# EAGLE schematic tda1543-iv-test (EAGLE 7.4.0)
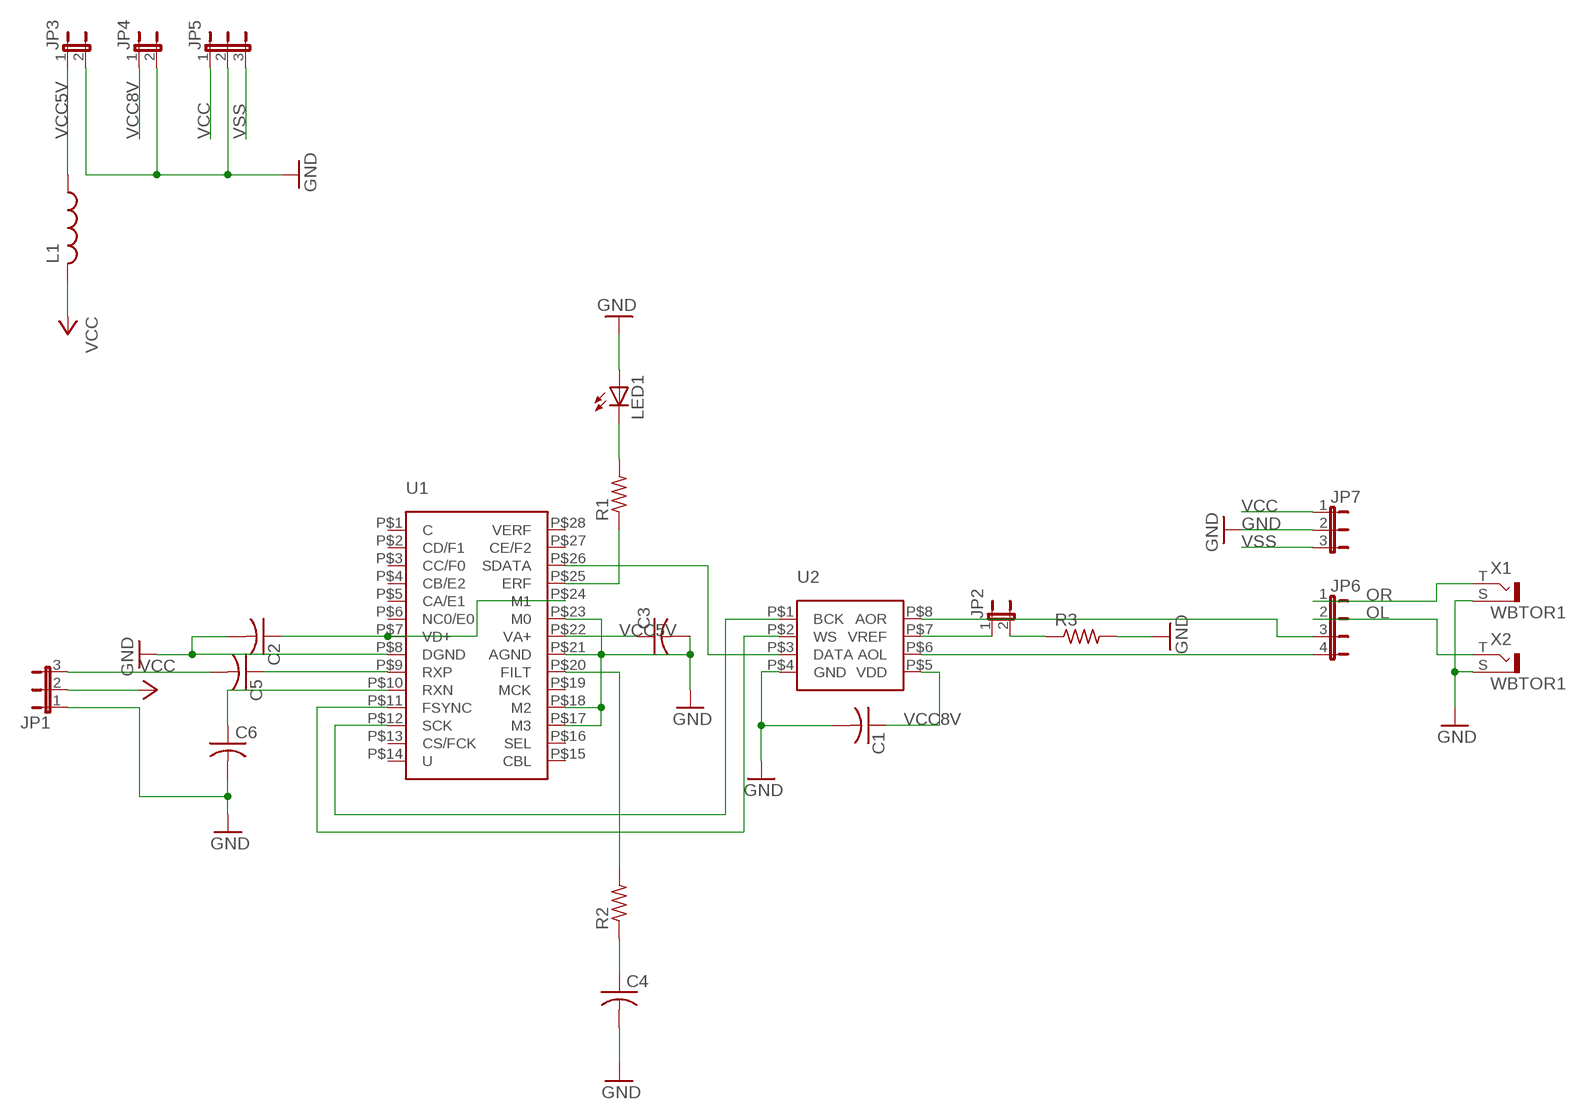
[diagram p0: schematic, sheet 1]

## Parts
C1  C-USC0805  [C0805]
C2  C-USC0805  [C0805]
C3  C-USC0805  [C0805]
C4  C-USC0805  [C0805]
C5  C-USC0805  [C0805]
C6  C-USC0805  [C0805]
JP1  JP2E  [JP2]
JP2  JP1E  [JP1]
JP3  JP1E  [JP1]
JP4  JP1E  [JP1]
JP5  JP2E  [JP2]
JP6  JP4E  [JP4]
JP7  JP2E  [JP2]
L1  L-USL2012C  [L2012C]
LED1  LED3MM  [LED3MM]
R1  R-US_R0805  [R0805]
R2  R-US_R0805  [R0805]
R3  R-US_R0805  [R0805]
U1  CS8412  [DIP14]
U2  TDA1543  [DIP8]
X1  WBTOR1  [WBTOR1]
X2  WBTOR1  [WBTOR1]

## Nets
GND: C1.2 C2.2 C3.2 C4.2 C6.2 JP1.1 JP3.2 JP4.2 JP5.2 JP7.2 LED1.A R3.2 U1.P$8(DGND) U1.P$17(M3) U1.P$18(M2) U1.P$21(AGND) U1.P$23(M0) U2.P$4(GND) X1.S X2.S
N$1: U1.P$12(SCK) U2.P$1(BCK)
N$2: U1.P$11(FSYNC) U2.P$2(WS)
N$4: U1.P$26(SDATA) U2.P$3(DATA)
N$5: C5.2 JP1.3
N$7: C2.1 U1.P$7(VD+) U1.P$24(M1)
N$9: JP2.1 U2.P$7(VREF)
N$10: JP2.2 R3.1
N$11: R1.1 U1.P$25(ERF)
N$12: LED1.K(C) R1.2
N$13: R2.2 U1.P$20(FILT)
N$14: C4.1 R2.1
N$15: C6.1 U1.P$10(RXN)
N$16: C5.1 U1.P$9(RXP)
N$18: JP6.3 U2.P$8(AOR)
N$19: JP6.4 U2.P$6(AOL)
OL: JP6.2 X2.T
OR: JP6.1 X1.T
VCC: JP1.2 JP5.1 JP7.1 L1.2
VCC5V: C3.1 JP3.1 L1.1 U1.P$22(VA+)
VCC8V: C1.1 JP4.1 U2.P$5(VDD)
VSS: JP5.3 JP7.3
Unconnected: U1.P$1(C) U1.P$2(CD/F1) U1.P$3(CC/F0) U1.P$4(CB/E2) U1.P$5(CA/E1) U1.P$6(NC0/E0) U1.P$13(CS/FCK) U1.P$14(U) U1.P$15(CBL) U1.P$16(SEL) U1.P$19(MCK) U1.P$27(CE/F2) U1.P$28(VERF)

## Library data of the parts
C1-C6 = rcl:C-US: CAPACITOR, American symbol
JP1 JP5 JP7 = jumper:JP2E: JUMPER
JP2-JP4 = jumper:JP1E: JUMPER
JP6 = jumper:JP4E: JUMPER
L1 = rcl:L-US: INDUCTOR, American symbol
LED1 = led:LED: LED OSRAM: - CHIPLED LG R971, LG N971, LY N971, LG Q971, LY Q971, LO R971, LY R971 LH N974, LH R974 LS Q976, LO Q976, LY Q976 LO Q996 - Hyper CHIPLED LW Q18S LB Q993, LB Q99A, LB R99A - SideLED LS A670, LO A670, LY A670, LG A670, LP A670 LB A673, LV A673, LT A673, LW A673 LH A674 LY A675 LS A676, LA A676, LO A676, LY A676, LW A676 LS A679, LY A679, LG A679 - Hyper Micro SIDELED® LS Y876, LA Y876, LO Y876, LY Y876 LT Y87S - SmartLED LW L88C, LW L88S LB L89C, LB L89S, LG L890 LS L89K, LO L89K, LY L89K LS L896, LA L896, LO L896, LY L896 - TOPLED LS T670, LO T670, LY T670, LG T670, LP T670 LSG T670, LSP T670, LSY T670, LOP T670, LYG T670 LG T671, LOG T671, LSG T671 LB T673, LV T673, LT T673, LW T673 LH T674 LS T676, LA T676, LO T676, LY T676, LB T676, LH T676, LSB T676, LW T676 LB T67C, LV T67C, LT T67C, LS T67K, LO T67K, LY T67K, LW E67C LS E67B, LA E67B, LO E67B, LY E67B, LB E67C, LV E67C, LT E67C LW T67C LS T679, LY T679, LG T679 LS T770, LO T770, LY T770, LG T770, LP T770 LB T773, LV T773, LT T773, LW T773 LH T774 LS E675, LA E675, LY E675, LS T675 LS T776, LA T776, LO T776, LY T776, LB T776 LHGB T686 LT T68C, LB T68C - Hyper Mini TOPLED® LB M676 - Mini TOPLED Santana® LG M470 LS M47K, LO M47K, LY M47K Source: http://www.osram.convergy.de LUXEON: - LUMILED® LXK2-PW12-R00, LXK2-PW12-S00, LXK2-PW14-U00, LXK2-PW14-V00 LXK2-PM12-R00, LXK2-PM12-S00, LXK2-PM14-U00 LXK2-PE12-Q00, LXK2-PE12-R00, LXK2-PE12-S00, LXK2-PE14-T00, LXK2-PE14-U00 LXK2-PB12-K00, LXK2-PB12-L00, LXK2-PB12-M00, LXK2-PB14-N00, LXK2-PB14-P00, LXK2-PB14-Q00 LXK2-PR12-L00, LXK2-PR12-M00, LXK2-PR14-Q00, LXK2-PR14-R00 LXK2-PD12-Q00, LXK2-PD12-R00, LXK2-PD12-S00 LXK2-PH12-R00, LXK2-PH12-S00 LXK2-PL12-P00, LXK2-PL12-Q00, LXK2-PL12-R00 Source: www.luxeon.com KINGBRIGHT: KA-3528ASYC Source: www.kingbright.com
R1-R3 = rcl:R-US_: RESISTOR, American symbol
U1 = chip:CS8412
U2 = chip:TDA1543
X1 X2 = con-lumberg:WBTOR1: RCA connectors according to JEITA RC-5231 Cinch RCA-Einbaukupplung nach JEITA RC-5231, abgewinkelte Ausführung Source: http://www.lumberg.de/Produkte/PDFs/WBTOR1.pdf; MPN: WBTOR 1 BLACK; OC_FARNELL: 1200146; OC_NEWARK: 98K2588